# EAGLE schematic can-weichendecoder-magnet (EAGLE 7.5.0)
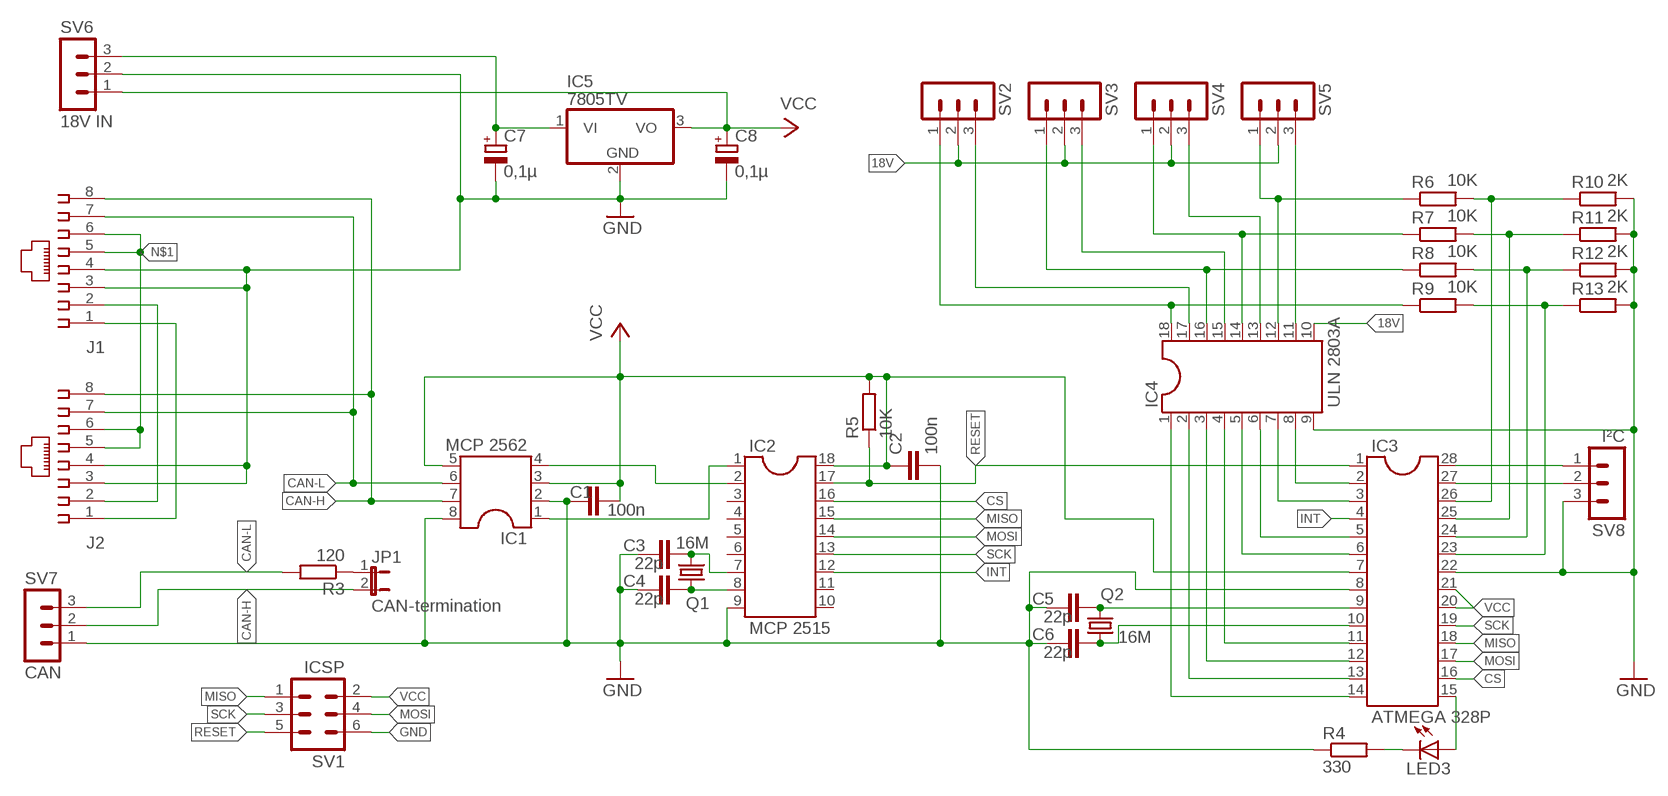
[diagram p0: schematic, sheet 1]

## Parts
C1  100n  C2.5/2  [C2.5-2]
C2  100n  C2.5/2  [C2.5-2]
C3  22p  C2.5/2  [C2.5-2]
C4  22p  C2.5/2  [C2.5-2]
C5  22p  C2.5/2  [C2.5-2]
C6  22p  C2.5/2  [C2.5-2]
C7  0,1µ  CPOL-EUE2.5-6  [E2,5-6]
C8  0,1µ  CPOL-EUE2.5-6  [E2,5-6]
IC1  MCP 2562  DIL8S  [SOCKET-08]
IC2  MCP 2515  DIL18S  [SOCKET-18]
IC3  ATMEGA 328P  DIL28-3  [DIL28-3]
IC4  ULN 2803A  DIL18S  [SOCKET-18]
IC5  7805TV  [TO220V]
J1  215877-7  [215877-7]
J2  215877-7  [215877-7]
JP1  CAN-termination  JP1E  [JP1]
LED3  LED5MM  [LED5MM]
Q1  16M  CRYSTALHC49S  [HC49/S]
Q2  16M  CRYSTALHC49S  [HC49/S]
R3  120  R-EU_0207/10  [0207/10]
R4  330  R-EU_0207/10  [0207/10]
R5  10K  R-EU_0207/10  [0207/10]
R6  10K  R-EU_0207/10  [0207/10]
R7  10K  R-EU_0207/10  [0207/10]
R8  10K  R-EU_0207/10  [0207/10]
R9  10K  R-EU_0207/10  [0207/10]
R10  2K  R-EU_0207/10  [0207/10]
R11  2K  R-EU_0207/10  [0207/10]
R12  2K  R-EU_0207/10  [0207/10]
R13  2K  R-EU_0207/10  [0207/10]
SV1  ICSP  MA03-2  [MA03-2]
SV2  MA03-1  [MA03-1]
SV3  MA03-1  [MA03-1]
SV4  MA03-1  [MA03-1]
SV5  MA03-1  [MA03-1]
SV6  18V IN  MA03-1  [MA03-1]
SV7  CAN  MA03-1  [MA03-1]
SV8  I²C  MA03-1  [MA03-1]

## Nets
18V: C7.+ IC4.10 IC5.1(VI) SV2.2 SV3.2 SV4.2 SV5.2 SV6.3
CAN-H: IC1.7 J1.8 J2.8 JP1.2 SV7.2
CAN-L: IC1.6 J1.7 J2.7 R3.2 SV7.3
CS: IC2.16 IC3.16
GND: C1.1 C2.2 C3.1 C4.1 C5.1 C6.1 C7.- C8.- IC1.2 IC1.8 IC2.9 IC3.8 IC3.22 IC4.9 IC5.2(GND) J1.3 J1.4 J2.3 J2.4 R4.1 R10.2 R11.2 R12.2 R13.2 SV1.6 SV6.2 SV7.1 SV8.3
INT: IC2.12 IC3.4
MISO: IC2.15 IC3.18 SV1.1
MOSI: IC2.14 IC3.17 SV1.4
N$1: J1.5 J1.6 J2.5 J2.6
N$2: IC1.4 IC2.2
N$3: J1.2 J2.2
N$4: C4.2 IC2.8 Q1.1
N$5: JP1.1 R3.1
N$6: C3.2 IC2.7 Q1.2
N$7: C5.2 IC3.9 Q2.2
N$8: C6.2 IC3.10 Q2.1
N$9: IC1.1 IC2.1
N$10: IC3.2 IC4.8
N$11: IC3.3 IC4.7
N$12: LED3.K(C) R4.2
N$13: IC3.15 LED3.A
N$14: IC3.5 IC4.6
N$15: IC3.6 IC4.5
N$16: IC3.11 IC4.4
N$17: IC3.12 IC4.3
N$18: IC3.13 IC4.2
N$19: IC3.14 IC4.1
N$20: IC4.18 R9.1 SV2.1
N$21: IC4.17 SV2.3
N$22: IC4.16 R8.1 SV3.1
N$23: IC4.15 SV3.3
N$24: IC4.14 R7.1 SV4.1
N$25: IC4.13 SV4.3
N$26: IC4.12 R6.1 SV5.1
N$27: IC4.11 SV5.3
N$28: IC3.26 R6.2 R10.1
N$29: IC3.25 R7.2 R11.1
N$30: IC3.24 R8.2 R12.1
N$31: IC3.23 R9.2 R13.1
N$32: J1.1 J2.1
N$33: IC3.28 SV8.1
N$34: IC3.27 SV8.2
RESET: IC2.17 IC3.1 R5.1 SV1.5
SCK: IC2.13 IC3.19 SV1.3
VCC: C1.2 C2.1 C8.+ IC1.3 IC1.5 IC2.18 IC3.7 IC3.20 IC3.21 IC5.3(VO) R5.2 SV1.2 SV6.1
Unconnected: IC2.3 IC2.4 IC2.5 IC2.6 IC2.10 IC2.11

## Library data of the parts
C1-C6 = capacitor-wima:C: CAPACITOR naming: grid - package width
C7 C8 = rcl:CPOL-EU: POLARIZED CAPACITOR, European symbol
IC1 = ic-package:DIL8: Dual In Line / Socket
IC2 IC4 = ic-package:DIL18: Dual In Line / Socket
IC3 = ic-package:DIL28: Dual In Line
IC5 = linear:78*: Positive VOLTAGE REGULATOR Source: http://cache.national.com/ds/LM/LM78L05.pdf http://www.fairchildsemi.com/ds/LM/LM7805.pdf
J1 J2 = con-amp:215877-7: AMP connector
JP1 = jumper:JP1E: JUMPER
LED3 = led:LED: LED OSRAM: - CHIPLED LG R971, LG N971, LY N971, LG Q971, LY Q971, LO R971, LY R971 LH N974, LH R974 LS Q976, LO Q976, LY Q976 LO Q996 - Hyper CHIPLED LW Q18S LB Q993, LB Q99A, LB R99A - SideLED LS A670, LO A670, LY A670, LG A670, LP A670 LB A673, LV A673, LT A673, LW A673 LH A674 LY A675 LS A676, LA A676, LO A676, LY A676, LW A676 LS A679, LY A679, LG A679 - Hyper Micro SIDELED® LS Y876, LA Y876, LO Y876, LY Y876 LT Y87S - SmartLED LW L88C, LW L88S LB L89C, LB L89S, LG L890 LS L89K, LO L89K, LY L89K LS L896, LA L896, LO L896, LY L896 - TOPLED LS T670, LO T670, LY T670, LG T670, LP T670 LSG T670, LSP T670, LSY T670, LOP T670, LYG T670 LG T671, LOG T671, LSG T671 LB T673, LV T673, LT T673, LW T673 LH T674 LS T676, LA T676, LO T676, LY T676, LB T676, LH T676, LSB T676, LW T676 LB T67C, LV T67C, LT T67C, LS T67K, LO T67K, LY T67K, LW E67C LS E67B, LA E67B, LO E67B, LY E67B, LB E67C, LV E67C, LT E67C LW T67C LS T679, LY T679, LG T679 LS T770, LO T770, LY T770, LG T770, LP T770 LB T773, LV T773, LT T773, LW T773 LH T774 LS E675, LA E675, LY E675, LS T675 LS T776, LA T776, LO T776, LY T776, LB T776 LHGB T686 LT T68C, LB T68C - Hyper Mini TOPLED® LB M676 - Mini TOPLED Santana® LG M470 LS M47K, LO M47K, LY M47K Source: http://www.osram.convergy.de LUXEON: - LUMILED® LXK2-PW12-R00, LXK2-PW12-S00, LXK2-PW14-U00, LXK2-PW14-V00 LXK2-PM12-R00, LXK2-PM12-S00, LXK2-PM14-U00 LXK2-PE12-Q00, LXK2-PE12-R00, LXK2-PE12-S00, LXK2-PE14-T00, LXK2-PE14-U00 LXK2-PB12-K00, LXK2-PB12-L00, LXK2-PB12-M00, LXK2-PB14-N00, LXK2-PB14-P00, LXK2-PB14-Q00 LXK2-PR12-L00, LXK2-PR12-M00, LXK2-PR14-Q00, LXK2-PR14-R00 LXK2-PD12-Q00, LXK2-PD12-R00, LXK2-PD12-S00 LXK2-PH12-R00, LXK2-PH12-S00 LXK2-PL12-P00, LXK2-PL12-Q00, LXK2-PL12-R00 Source: www.luxeon.com KINGBRIGHT: KA-3528ASYC Source: www.kingbright.com
Q1 Q2 = crystal:CRYSTAL: CRYSTAL; OC_FARNELL: 1667008; OC_NEWARK: unknown
R3-R13 = rcl:R-EU_: RESISTOR, European symbol
SV1 = con-lstb:MA03-2: PIN HEADER; OC_FARNELL: unknown; OC_NEWARK: unknown
SV2-SV8 = con-lstb:MA03-1: PIN HEADER; OC_FARNELL: unknown; OC_NEWARK: unknown